# EAGLE design STM8L001_TX_v2 (EAGLE 6.4)
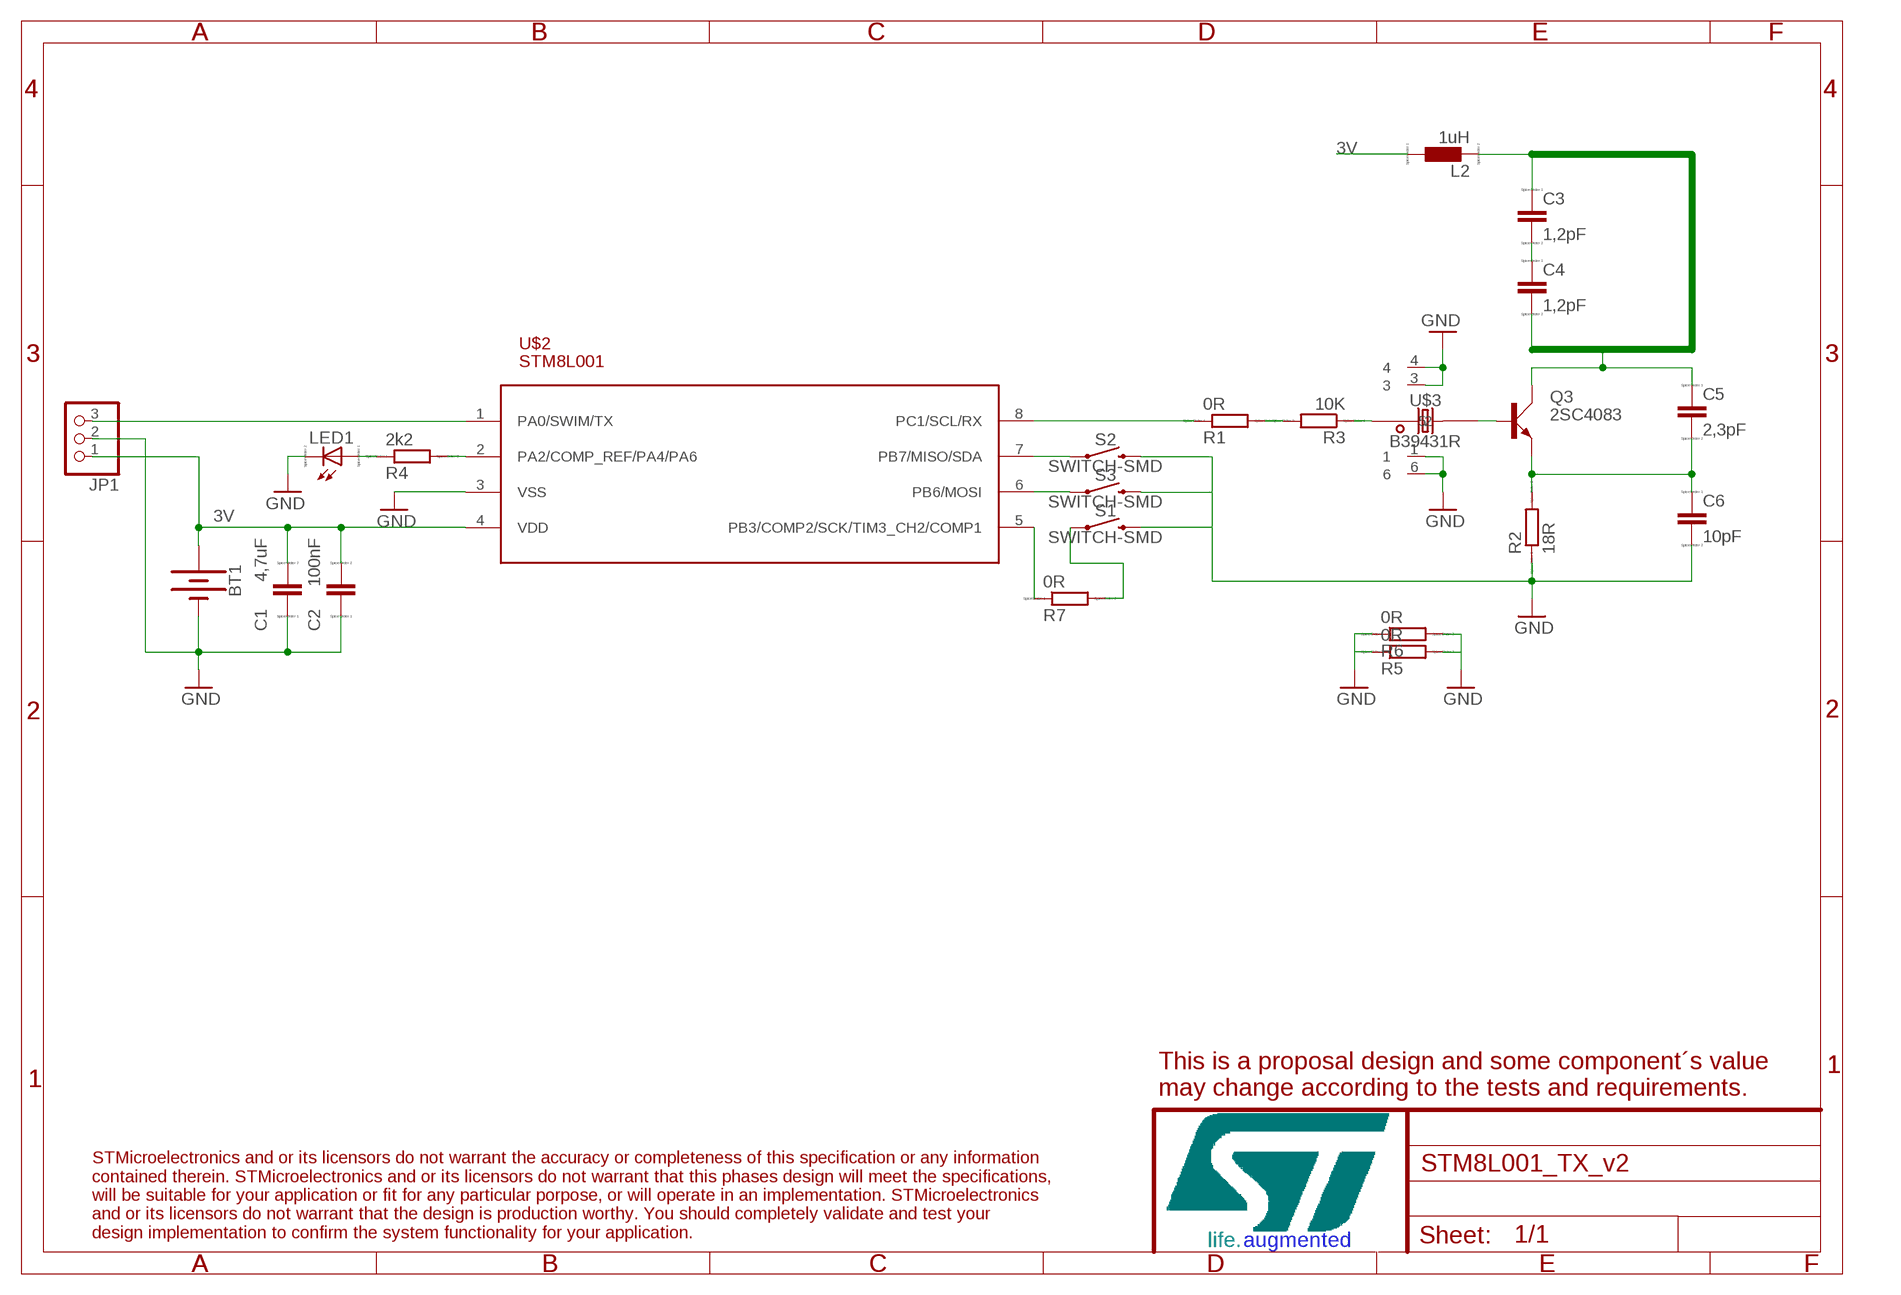
[diagram p0: schematic, sheet 1]

## Parts
BT1  BATTERY-20MM_PTH  [BATTCOM_20MM_PTH]
C1  4,7uF  CC0603  [C0603]
C2  100nF  CC0603  [C0603]
C3  1,2pF  CC0402  [C0402]
C4  1,2pF  CC0402  [C0402]
C5  2,3pF  CC0402  [C0402]
C6  10pF  CC0402  [C0402]
JP1  PINHD-1X3  [1X03]
L2  1uH  LL3230M  [L3230M]
LED1  LED_ESML0603  [LED_SML0603]
Q3  2SC4083  [UMT3]
R1  0R  RR1206  [R1206]
R2  18R  RR0402  [R0402]
R3  10K  RR0402  [R0402]
R4  2k2  RR1206  [R1206]
R5  0R  RR1206  [R1206]
R6  0R  RR1206  [R1206]
R7  0R  RR1206  [R1206]
S1  SWITCH-SMD  MOMENTARY-SWITCH-SPST-SMD-6.0X3.5MM  [TACTILE_SWITCH_SMD_6.0X3.5MM]
S2  SWITCH-SMD  MOMENTARY-SWITCH-SPST-SMD-6.0X3.5MM  [TACTILE_SWITCH_SMD_6.0X3.5MM]
S3  SWITCH-SMD  MOMENTARY-SWITCH-SPST-SMD-6.0X3.5MM  [TACTILE_SWITCH_SMD_6.0X3.5MM]
U$2  STM8L001  [SO08]
U$3  B39431R  [SON120P300X300X110-6N]

## Nets
3V: BT1.1(+) C1.2 C2.2 JP1.1 L2.1 U$2.4(VDD)
GND: BT1.2(-) C1.1 C2.1 C6.2 JP1.2 LED1.C R2.1 R5.1 R5.2 R6.1 R6.2 S1.2 S2.2 S3.2 U$2.3(VSS) U$3.1 U$3.3 U$3.4 U$3.6
N$1: R3.1 U$3.2
N$2: C3.1 C4.2 C5.1 L2.2 Q3.3(C)
N$3: R4.2 U$2.2(PA2/COMP_REF/PA4/PA6)
N$4: S3.1 U$2.6(PB6/MOSI)
N$5: C5.2 C6.1 Q3.1(E) R2.2
N$6: LED1.A R4.1
N$7: C3.2 C4.1
N$8: JP1.3 U$2.1(PA0/SWIM/TX)
N$9: S2.1 U$2.7(PB7/MISO/SDA)
N$10: R1.2 R3.2
N$11: R7.2 S1.1
N$12: R1.1 U$2.8(PC1/SCL/RX)
N$13: R7.1 U$2.5(PB3/COMP2/SCK/TIM3_CH2/COMP1)
N$14: Q3.2(B) U$3.5

## Library data of the parts
BT1 = SparkFun-Batteries:BATTERY: Battery - Single Cell A variety of battery chemistries, sizes, and footprints. Device List: 20MM_PTH - Coin Cell Battery Holder - 20mm (PTH) <https://www.sparkfun.com/products/783> 12MM_SMD - Coin Cell Battery Holder - 12mm (SMD) <https://www.sparkfun.com/products/10592> 12MM_PTH - Coin Cell Battery Holder - 12mm (PTH) <https://www.sparkfun.com/products/7948> 20MM_SMD - 20mm Coin Cell Battery Holder (SMD) (2 legs) Used on the Big Time Watch Kit <https://www.sparkfun.com/products/11734> 20MM_SMD_4LEGS - Coin Cell Battery Holder - 20mm (SMD) <https://www.sparkfun.com/products/11892> 20MM_SMD_4LEGS_OVERPASTE - Coin Cell Battery Holder - 20mm (SMD) <https://www.sparkfun.com/products/11892> (Over-paste on the legs) 24.5MM_PTH - Coin Cell Battery Holder - 24.5mm (PTH) <https://www.sparkfun.com/products/8863> 9V - 9V Battery Holder - PC Mount Used on the SparkFun SparkPunk Sound Kit <https://www.sparkfun.com/products/11177> and SparkFun SparkPunk Sequencer Kit <https://www.sparkfun.com/products/12707> 18650 - Battery Holder - 18650 (PTH) <https://www.sparkfun.com/products/13113> AA - Battery Holder - 1xAA (PTH) <https://www.sparkfun.com/products/7949> AAA - Battery Holder - 1xAAA (PTH) <https://www.sparkfun.com/products/12718> AA_KIT - Battery Holder - 1xAA (PTH) <https://www.sparkfun.com/products/7949> Special kit package - pads only have exposed copper on one side of the board. AAA_KIT - Battery Holder - 1xAAA (PTH) <https://www.sparkfun.com/products/12718> Special kit package - pads only have exposed copper on one side of the board.; PROD_ID: BATT-09031; SF_SKU: PRT-00783
C1-C6 = eagle-ltspice:C: CAPACITOR, European symbol; SPICEMODEL: NONE; SPICEPREFIX: C
JP1 = pinhead:PINHD-1X3: PIN HEADER
L2 = eagle-ltspice:L: INDUCTOR, European symbol; SPICEMODEL: NONE; SPICEPREFIX: L
LED1 = eagle-ltspice:LED_E: LED Source: http://www.osram.convergy.de Source: www.luxeon.com Source: www.kingbright.com; SPICEMODEL: NONE; SPICEPREFIX: D; SPICETYPE: diode
Q3 = transistor-small-signal:2SC4083: High-Frequency Amplifier Transistor 11V, 50mA, 3.2GHz (Rohm)
R1-R7 = eagle-ltspice:R: RESISTOR, European symbol; SPICEMODEL: NONE; SPICEPREFIX: R
S1-S3 = SparkFun-Switches:MOMENTARY-SWITCH-SPST: Momentary Switch (Pushbutton) - SPST Normally-open (NO) SPST momentary switches (buttons, pushbuttons). Variants PTH-12MM - 12mm square, through-hole Momentary Pushbutton Switch - 12mm Square <https://www.sparkfun.com/products/9190> (COM-09190) PTH-6.0MM, PTH-6.0MM-KIT - 6.0mm square, through-hole Mini Pushbutton Switch <https://www.sparkfun.com/products/97> (COM-00097) KIT package intended for soldering kit's - only one side of pads' copper is exposed. PTH-RIGHT-ANGLE-KIT - Right-angle, through-hole Right Angle Tactile Button <https://www.sparkfun.com/products/10791> - Used on SparkFun BigTime Watch Kit <https://www.sparkfun.com/products/11734> SMD-12MM - 12mm square, surface-mount Tactile Button - SMD (12mm) <https://www.sparkfun.com/products/12993> (COM-12993) Used on SparkFun PicoBoard <https://www.sparkfun.com/products/11888> SMD-4.5MM - 4.5mm Square Trackball Switch Used on SparkFun Blackberry Trackballer Breakout <https://www.sparkfun.com/products/13169> SMD-4.6MMX2.8MM - 4.60mm x 2.80mm, surface mount Used on SparkFun SAMD21 Mini Breakout <https://www.sparkfun.com/products/13664> SMD-5.2MM, SMD-5.2-REDUNDANT - 5.2mm square, surface-mount Mini Pushbutton Switch - SMD <https://www.sparkfun.com/products/8720> (COM-08720) Used on Arduino Pro Mini <https://www.sparkfun.com/products/11114> REDUNDANT package connects both switch circuits together SMD-6.0X3.5MM - 6.0 x 3.5mm, surface mount Momentary Reset Switch SMD <https://www.sparkfun.com/products/8229> (COM-08229) SMD-6.2MM-TALL - 6.2mm square, surface mount Tactile Button - SMD (6mm) <https://www.sparkfun.com/products/12992> Used on SparkFun Digital Sandbox <https://www.sparkfun.com/products/12651> SMD-RIGHT-ANGLE - Right-angle, surface mount Used on SparkFun Block for Intel® Edison - Arduino <https://www.sparkfun.com/products/13036>; PROD_ID: SWCH-00815; SF_SKU: COM-08229
U$2 = ST_Controllers:STM8L001
U$3 = SON120P300X300X110-6N:B39431R

## Board
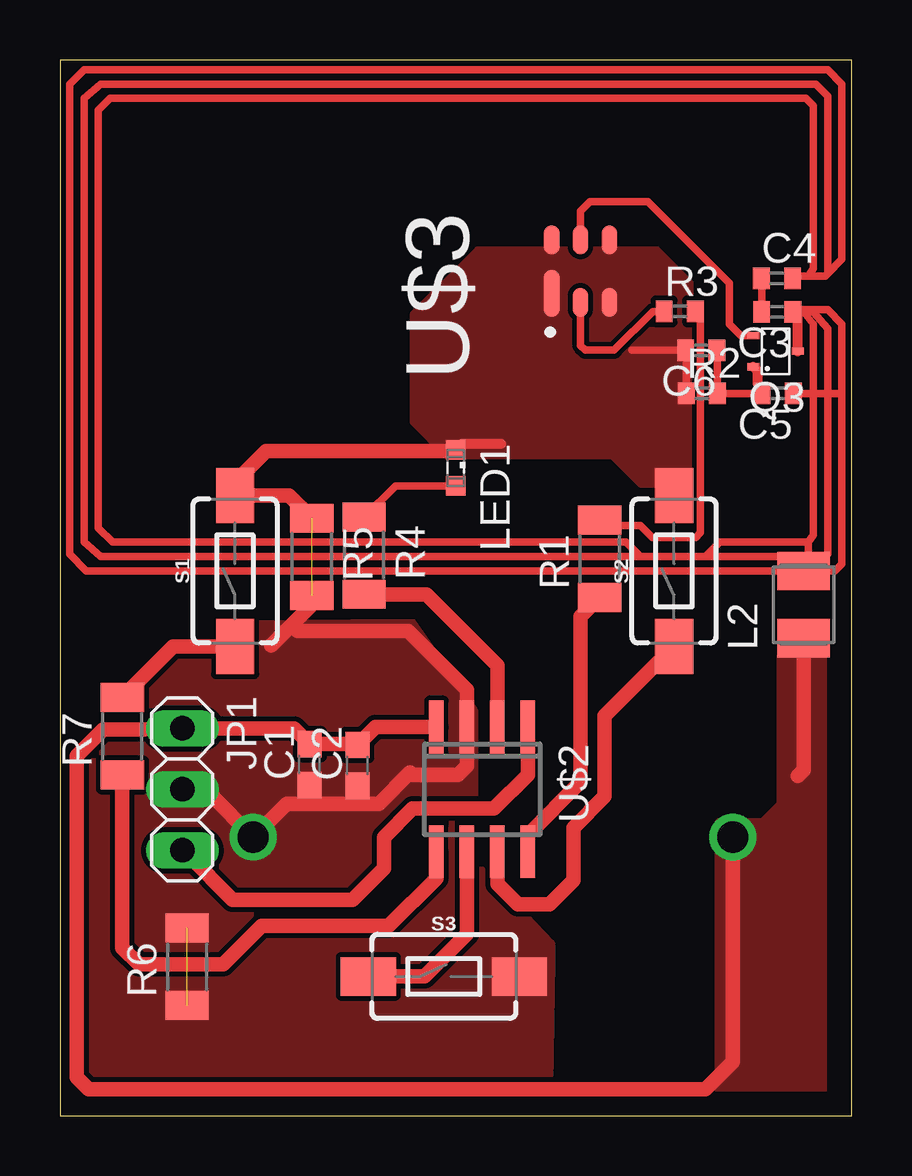
[diagram p1: board, top side]
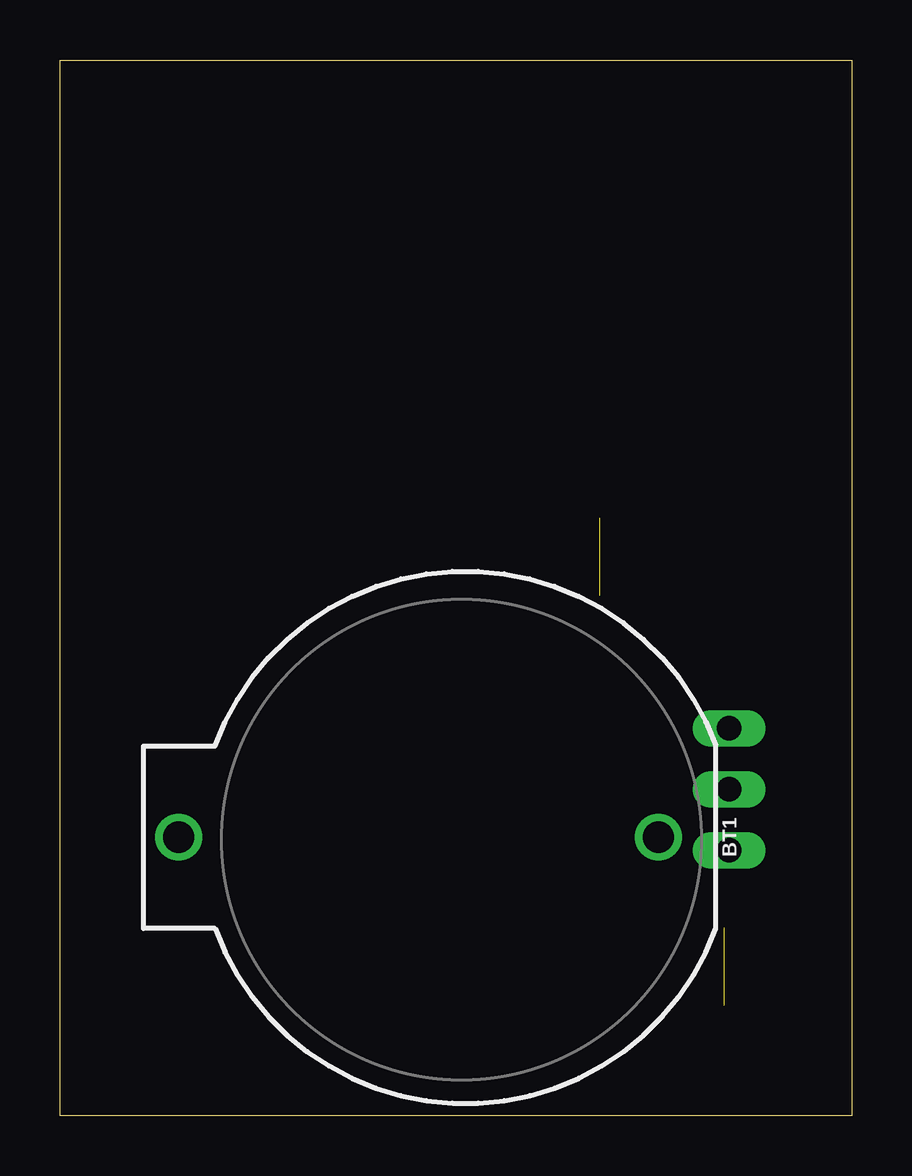
[diagram p2: board, bottom side, seen from below]

Size 33 x 44 mm. Coordinates in mm from the lower left corner, seen from the top.
Outline: 0,0 33,0 33,44 0,44 0,0
Copper layers (1*16): Top 0.035mm / dielectric 1.5mm / Bottom 0.035mm
Design rules "default": minimum track width 10mil, minimum drill 24mil, track to track 8mil, track to pad 8mil, pad to pad 8mil, via to via 8mil, smd to smd 8mil, copper to edge 40mil, drill to drill 8mil, minimum pad ring 10mil, minimum via ring 8mil, stop-mask expansion 4mil, vias tented up to drill 0mil, thermal gap 10mil

### Footprints (pad centres in the part's own frame; a part is rotated, then mirrored left to right if it is on the bottom)
BATTCOM_20MM_PTH = drill 1.3: 1 11.85,0; 2 -8.15,0
C0603 = smd 1.1 x 1: 1 -0.85,0; 2 0.85,0
C0402 = smd 0.7 x 0.9: 1 -0.65,0; 2 0.65,0
1X03 = drill 1.016 long: 1 -2.54,0; 2 0,0; 3 2.54,0
L3230M = smd 1.6 x 2.2: 1 -1.4,0; 2 1.4,0
LED_SML0603 = smd 0.8 x 0.8: A 0.75,0; C -0.75,0
UMT3 = smd 0.5 x 0.3: 1 1.595,0.19; 2 1.595,-1.11; 3 -0.255,-0.46
R1206 = smd 1.2 x 1.803: 1 -1.6,0; 2 1.622,0
R0402 = smd 0.7 x 0.9: 1 -0.65,0; 2 0.65,0
TACTILE_SWITCH_SMD_6.0X3.5MM = smd 2.3 x 1.6: 1 -3.15,0; 2 3.15,0
SO08 = smd 0.6 x 2.2: 1 -1.905,-2.6; 2 -0.635,-2.6; 3 0.635,-2.6; 4 1.905,-2.6; 5 1.905,2.6; 6 0.635,2.6; 7 -0.635,2.6; 8 -1.905,2.6
SON120P300X300X110-6N = smd 1.96 x 0.65: 1 -0.93,1.2 | smd 1.2 x 0.65: 2 -1.3,0; 3 -1.3,-1.2; 4 1.3,-1.2; 5 1.3,0; 6 1.3,1.2

### Placement (x,y rotation side)
BT1  16.2,11.6 180 bottom
C1  10.41,14.63 90 top
C2  12.4,14.6 90 top
C3  29.9,33.5 180 top
C4  29.89,34.9 0 top
C5  29.92,30.1 180 top
C6  26.73,31.9 180 top
JP1  5.1,13.6 270 top
L2  31,21.3 90 top
LED1  16.5,27 270 top
Q3  30.5,31.4 180 top
R1  22.5,23.2 90 top
R2  26.76,30.1 0 top
R3  25.84,33.52 0 top
R4  12.68,23.35 270 top
R5  10.5,23.3 270 top
R6  5.3,6.2 90 top
R7  2.6,15.8 90 top
S1  7.3,22.7 90 top
S2  25.6,22.7 90 top
S3  16,5.8 0 top
U$2  17.6,13.6 180 top
U$3  21.7,35.2 90 top

### Tracks (layer width: path | path; a pad name or v marks a point on that pad's centre or on a via)
3V
  Top 0.61: L2.1 31,14.4 30.75,14.15 | BT1.1 28.05,2.25 26.9,1.1 1.2,1.1 0.7,1.6 0.7,15 1.8,16.1 3.54,16.1 JP1.1 9.75,16.14 C1.2 12.37,15.48 C2.2 13.15,16.2 U$2.4
  pour Top (no thermals): 33,-0.2 27.8,-0.2 27.5,0.1 27.5,12.2 29.3,12.2 30.1,13 30.1,19.2 30.4,19.5 31.9,19.5 32.3,19.1 32.3,6.3 32.9,5.7 32.9,1.3 33,1.2
GND  (2 unrouted)
  Top 0.305: R2.1 26.11,31.87 C6.2 23.84,31.9
  Top 0.406: 18.4,28 16.75,28 LED1.C
  Top 0.61: JP1.2 6.25,13.4 BT1.2 9.45,13 13.3,13 14.6,14.3 14.7,14.2 16.6,14.2 16.96,14.56 U$2.3 16.96,17.73 14.5,20.2 9.9,20.2 9.65,20.45 | LED1.C 16.45,27.7 8.6,27.7 7.3,26.4 S1.2 9.55,25.85 R5.1 | R5.2 10.5,21.3 9.65,20.45 | 9.65,20.45 8.8,19.6
  pour Top (no thermals): 17.7,0 1.8,0.1 0.5,1.4 0.5,18.5 1.8,20.5 14.7,20.6 17.3,16.9 17.3,10.6 20.5,7.2 20.5,6.4 20.4,0 18.5,0.1 17.9,0
  pour Top (no thermals): 22.1,36.1 17.4,36.1 14.7,33.4 14.7,28.9 16.1,27.5 23,27.5 24.2,26.3 26.3,26.3 26.3,34.7 25,36 24.9,36.1
N$1
  Top 0.305: R3.1 24.72,33.52 23.1,31.9 21.9,31.9 21.7,32.1 U$3.2
N$2
  Top 0.305: C4.2 30.54,34.94 30.6,35 31.2,35 | 32,35.1 32.6,35.7 32.6,43 32,43.6 1,43.6 0.4,43 0.4,23.4 1.1,22.7 L2.2 | L2.2 32.3,22.7 32.6,23 32.6,30.1 | 32.6,30.1 32.6,33 32,33.6 30.7,33.6 30.6,33.5 | 30.6,33.5 31,33.5 | 31,33.5 31.4,33.5 32,32.8 32,23.4 31.7,23 | 31.6,23.3 26.9,23.3 | 24.2,23.3 1.7,23.3 1,23.9 1,42.4 1.7,43 31.5,43 32,42.5 32,35.1 | 32,35.1 31.9,35 31.2,35 | 31.2,35 31.4,35.3 31.4,42.1 31.1,42.4 2.1,42.4 1.6,41.9 1.6,24.5 2.2,23.9 23.6,23.9 24.2,23.3 | 31,33.5 31.4,33 31.4,24.2 31.2,23.9 | 30.6,33.5 C3.1 30.5,33.5 | C5.1 32.6,30.1 | 31.2,23.9 31.2,22.9 L2.2 | 24.2,23.3 26.9,23.3 | 26.9,23.3 27.5,23.9 31.2,23.9
  Top 0.406: Q3.3 30.75,33.3 C3.1
N$3
  Top 0.61: U$2.2 18.23,18.77 15.27,21.73 R4.2
N$4
  Top 0.61: S3.1 15.2,5.8 16.96,7.57 U$2.6
N$5
  Top 0.305: 29.1,30.47 C5.2 R2.2 27.41,31.87 C6.1
  Top 0.406: 29.1,30.47 29.1,31.02 Q3.1
N$6
  Top 0.305: LED1.A 13.98,26.25 R4.1
N$7
  Top 0.305: C3.2 C4.1
N$8
  Top 0.61: JP1.3 5.34,10.86 7.2,9 12.2,9 13.5,10.3 13.5,11.6 14.7,12.8 18.1,12.8 19.5,14.21 U$2.1
N$9
  Top 0.61: S2.1 22.7,16.65 22.7,13.3 21.4,12 21.4,9.8 20.4,8.8 19.1,8.8 18.23,9.66 U$2.7
N$10
  Top 0.305: R1.2 22.72,24.6 24.2,24.6 24.7,24.1 26.5,24.1 26.7,24.3 26.7,33.31 R3.2
N$11
  Top 0.61: S1.1 4.73,19.55 R7.2
N$12
  Top 0.61: U$2.8 19.5,11.71 21.7,13.9 21.7,20.8 R1.1
N$13
  Top 0.61: R7.1 2.6,7 3.3,6.3 6.8,6.3 8.4,7.9 13.7,7.9 15.7,9.89 U$2.5
N$14
  Top 0.305: U$3.5 21.7,37.7 22.1,38.1 24.5,38.1 27.9,34.7 27.9,33 28.39,32.51 Q3.2